# EasyEDA Pro project 01_立创eda专业版_esp32语音助手-自制版_2024-07-09.epro, board PCB1
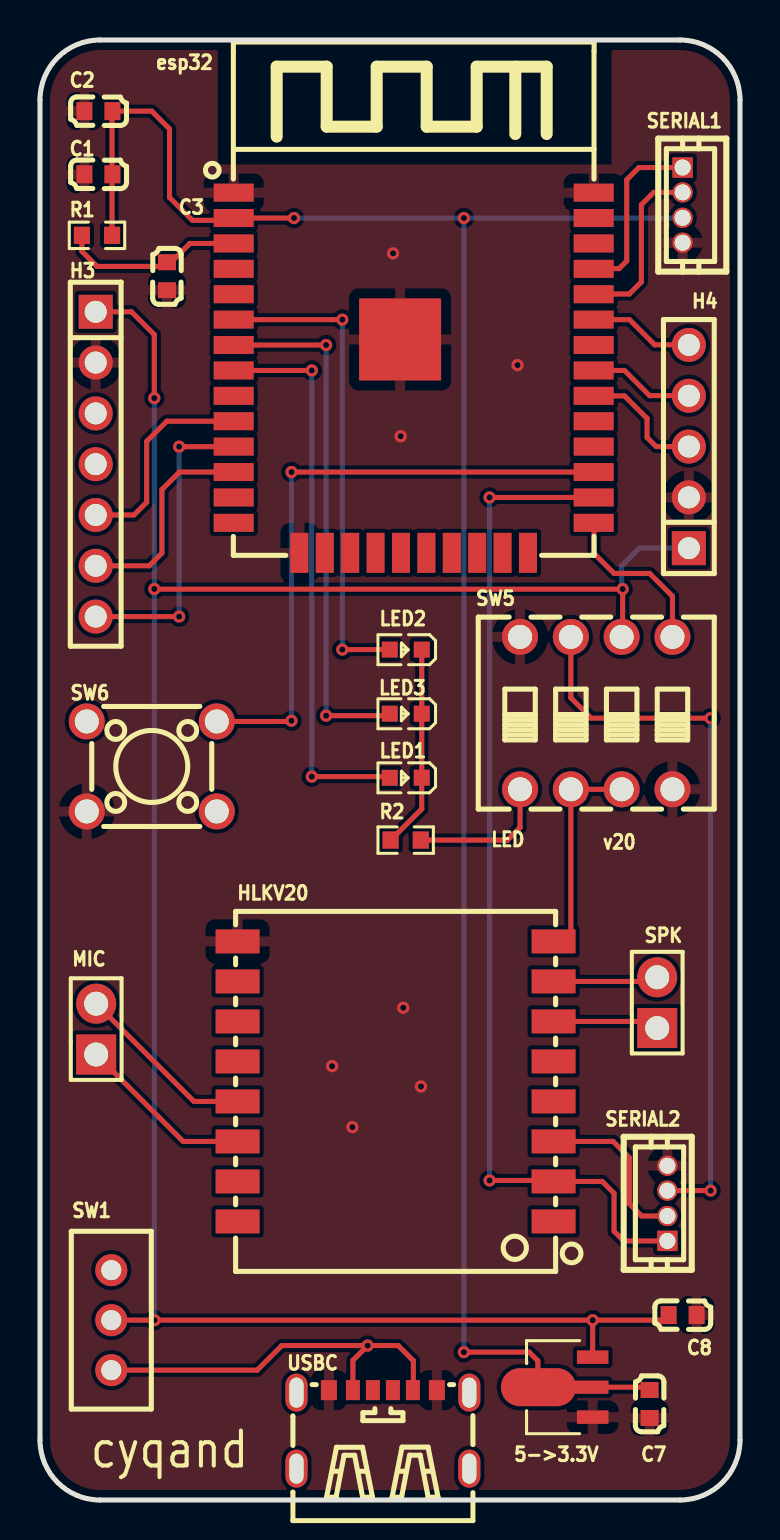
[diagram p14: board, top side]
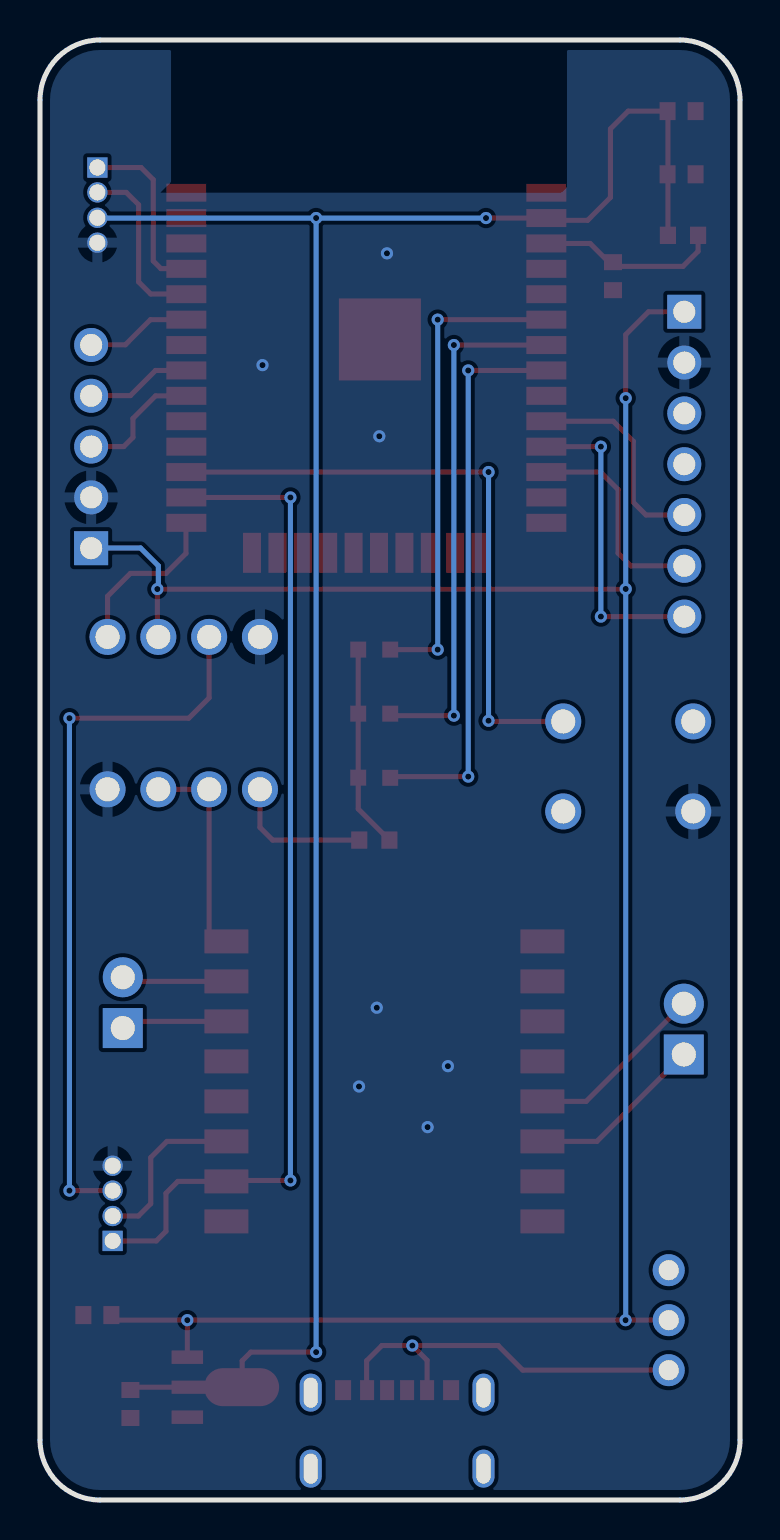
[diagram p15: board, bottom side, seen from below]

Outline 35 x 73 mm; copper layers: Top Layer, Bottom Layer. Coordinates in mm from the lower left corner of the outline.
Outline path: 0,70 0,3 arc(0.88,0.88) 3,0 32,0 arc(34.12,0.88) 35,3 35,70 arc(34.12,72.12) 32,73 3,73 arc(0.88,72.12) 0,70
Stack: Top Layer 0.035mm / Dielectric1 1.51mm FR4 er 4.5 / Bottom Layer 0.035mm

## Design rules (mm)
template: JLCPCB Capability(Two Layers Board)
spacing copperThickness1oz (default): track to track 0.102, other pairs 0.152 to 0.3
spacing copperThickness2oz: track to track 0.203, other pairs 0.152 to 0.3
track width copperThickness1oz (default): min 0.127, default 0.254, max 2.54
track width copperThickness2oz: min 0.203, default 0.254, max 2.54
differential pair differentialPair (default): width min 0.127, default 0.254, max 2.54; gap min 0.152, default 0.152
via viaSize (default): diameter min 0.5, default 0.61, max 10; hole min 0.3, default 0.305, max 6.3

## Placement (name value [footprint] x y rotation side)
5->3.3V  AMS1117-3.3V  [SOT-89-3_L4.5-W2.5-P1.50-LS4.2-BR]  26.28 5.64 0 top
C1  100nF  [C0603]  2.92 66.29 180 top
C2  10uF  [C0603]  2.92 69.44 180 top
C3  100nF  [C0603]  6.35 61.19 90 top
C7  10uF  [C0603]  30.48 4.8 270 top
C8  10uF  [C0603]  32.13 9.25 180 top
esp32  ESP32-WROOM-32-N4  [WIFIM-SMD_ESP32-WROOM-32-N4]  18.68 56.36 0 top
H3  PZ254V-11-07P  [HDR-TH_7P-P2.54-V-M]  2.79 51.79 270 top
H4  PZ254V-11-05P  [HDR-TH_5P-P2.54-V-M]  32.44 52.67 90 top
HLKV20  HLK-V20  [SMD-16_L18.0-W16.0-P2.00-HLK-V20]  17.78 20.93 180 top
LED1  NCD0603R1  [LED0603-RD_RED]  18.29 36.11 180 top
LED2  NCD0603G1  [LED0603-RD]  18.29 42.52 180 top
LED3  NCD0603B1  [LED0603-RD]  18.29 39.32 180 top
MIC  PZ254V-11-02P  [HDR-TH_2P-P2.54-V-M]  2.81 23.55 90 top
R1  10kΩ  [R0603]  2.85 63.23 0 top
R2  1kΩ  [R0603]  18.28 33 180 top
SERIAL1  DF13-4P-1.25DSA  [CONN-TH_DF13-4P-1.25DSA]  32.13 64.75 90 top
SERIAL2  DF13-4P-1.25DSA  [CONN-TH_DF13-4P-1.25DSA]  31.37 14.83 270 top
SPK  PZ254V-11-02P  [HDR-TH_2P-P2.54-V-M]  30.86 24.87 90 top
SW1  SS-12D00-G3  [SW-TH_SS-12D00-G3]  3.56 8.99 90 top
SW5  DSWB04LHGET  [SW-TH_DSWB04LHGET]  27.81 39.34 0 top
SW6  TS-1002-07026  [SW-TH_4P-L6.0-W6.0-P4.50-LS6.5]  5.59 36.68 0 top
USBC  TYPE-C 6P(073)  [TYPE-C-SMD_TYPE-C-6P]  17.15 3.53 0 top

## Footprints (pads in the part's own frame, mm; a bottom-side part is the same pattern mirrored in y, then rotated)
C0603
  rect 0.8x0.9 smd: 1(-0.7,0) 2(0.7,0)
CONN-TH_DF13-4P-1.25DSA
  rect 1.016x1.016 hole 0.8: 1(1.879,0)
  round 1.016 hole 0.8: 2(0.635,0) 3(-0.635,0) 4(-1.879,0)
HDR-TH_2P-P2.54-V-M
  rect 2x2 hole 1.2: 1(-1.27,0)
  round 2 hole 1.2: 2(1.27,0)
HDR-TH_5P-P2.54-V-M
  rect 1.7x1.7 hole 1.1: 1(-5.08,0)
  round 1.7 hole 1.1: 2(-2.54,0) 3(0,0) 4(2.54,0) 5(5.08,0)
HDR-TH_7P-P2.54-V-M
  rect 1.7x1.7 hole 1.1: 1(-7.62,0)
  round 1.7 hole 1.1: 2(-5.08,0) 3(-2.54,0) 4(0,0) 5(2.54,0) 6(5.08,0) 7(7.62,0)
LED0603-RD
  rect 0.8x0.8 smd: 1(-0.799,0) 2(0.799,0)
LED0603-RD_RED
  rect 0.8x0.8 smd: 1(-0.799,-0.004) 2(0.799,0.004)
R0603
  rect 0.806x0.864 smd: 1(-0.753,0) 2(0.753,0)
SMD-16_L18.0-W16.0-P2.00-HLK-V20
  rect 2.2x1.2 smd: 1(-7.9,7) 2(-7.9,5) 3(-7.9,3) 4(-7.9,1) 5(-7.9,-1) 6(-7.9,-3) 7(-7.9,-5) 8(-7.9,-7) 9(7.9,-7) 10(7.9,-5) 11(7.9,-3) 12(7.9,-1) 13(7.9,1) 14(7.9,3) 15(7.9,5) 16(7.9,7)
SOT-89-3_L4.5-W2.5-P1.50-LS4.2-BR
  rect 1.575x0.672 smd: 1(1.356,-1.5) 3(1.356,1.5)
  custom 5.377x1.9 smd: 2(-1.356,0)
SW-TH_4P-L6.0-W6.0-P4.50-LS6.5
  round 1.8 hole 1.2: 1(-3.25,2.25) 2(3.25,2.25) 3(-3.25,-2.25) 4(3.25,-2.25)
SW-TH_DSWB04LHGET
  round 1.8 hole 1.2: 1(-3.81,3.81) 2(-1.27,3.81) 3(1.27,3.81) 4(3.81,3.81) 5(-3.81,-3.81) 6(-1.27,-3.81) 7(1.27,-3.81) 8(3.81,-3.81)
SW-TH_SS-12D00-G3
  round 1.6 hole 1: 1(-2.5,0) 2(0,0) 3(2.5,0)
TYPE-C-SMD_TYPE-C-6P
  oval 1.1x1.9 hole 0.7x1.5: 7(-4.32,1.837) 7(-4.32,-1.962) 7(4.32,1.837) 7(4.32,-1.962)
  rect 0.7x1 smd: A5(-0.5,1.962) A9(1.5,1.962) B5(0.5,1.962) B9(-1.5,1.962)
  rect 0.8x1 smd: A12(2.7,1.962) B12(-2.7,1.962)
WIFIM-SMD_ESP32-WROOM-32-N4
  rect 2x0.9 smd: 1(-9,9.005) 2(-9,7.735) 3(-9,6.465) 4(-9,5.195) 5(-9,3.925) 6(-9,2.655) 7(-9,1.385) 8(-9,0.115) 9(-9,-1.155) 10(-9,-2.425) 11(-9,-3.695) 12(-9,-4.965) 13(-9,-6.235) 14(-9,-7.505) 25(9,-7.505) 26(9,-6.235) 27(9,-4.965) 28(9,-3.695) 29(9,-2.425) 30(9,-1.155) 31(9,0.115) 32(9,1.385) 33(9,2.655) 34(9,3.925) 35(9,5.195) 36(9,6.465) 37(9,7.735) 38(9,9.005)
  rect 0.9x2 smd: 15(-5.715,-9.005) 16(-4.445,-9.005) 17(-3.175,-9.005) 18(-1.905,-9.005) 19(-0.635,-9.005) 20(0.635,-9.005) 21(1.905,-9.005) 22(3.175,-9.005) 23(4.445,-9.005) 24(5.715,-9.005)
  rect 4.1x4.1 smd: 39(-0.68,1.665)

## Nets
As in the schematic.

Pads without a net: esp32 4 5 9 13 14 16 17 18 19 20 21 22 23 24 28 29 32 36 37; H3 3 4; HLKV20 1 4 5 10 11 12 15 16; SW1 3; SW6 1 4; USBC 7 A5 B5

## Via types
v1: diameter 0.61, hole 0.305, Top Layer to Bottom Layer, 30 vias

## Routing (per net, layer and track width the routed paths; a pad name or vN(x,y) marks a point on that pad's centre or on a via; arc(x,y) is an arc through that point)
3V3: length 105.8
  Top Layer w0.254: v1(21.19,7.39) 24.46,7.39 24.89,6.96 24.89,5.67 5->3.3V.2 ; 25.73,5.64 30.34,5.64 C7.1 ; R1.2 3.6,69.43 C2.1 5.59,69.44 6.48,68.56 6.48,65.13 7.62,63.98 9.57,63.98 esp32.2 v1(12.7,64.1)
  Bottom Layer w0.254: v1(12.7,64.1) 32.12,64.1 SERIAL1.3 ; v1(21.19,7.39) v1(21.19,64.1)
5V: length 113.2
  Top Layer w0.254: H3.1 4.57,59.41 5.72,58.27 v1(5.72,55.09) ; SW1.2 31.18,8.99 C8.2 ; 5.72,45.54 29.08,45.54 ; 5->3.3V.3 v1(27.63,8.99) ; v1(29.13,45.55) 29.13,43.2 SW5.3
  Bottom Layer w0.254: v1(5.72,55.09) 5.72,8.99 ; 29.08,45.54 29.08,46.71 29.97,47.6 32.43,47.6 H4.1
  vias: v1(5.72,45.55) v1(5.72,8.99)
5VIN: length 19.9
  Top Layer w0.254: SW1.1 10.86,6.49 12.09,7.72 v1(16.38,7.72) ; v1(16.38,7.72) 15.65,6.98 USBC.B9 ; v1(16.38,7.72) 17.91,7.72 18.67,6.96 18.67,5.52 USBC.A9
GND:
  vias: v1(14.6,21.69) v1(15.62,18.64) v1(17.65,62.33) v1(18.03,53.19) v1(18.16,24.61) v1(19.05,20.68) v1(23.88,56.74)
IO4: length 50.6
  Top Layer w0.254: v1(22.48,15.98) 25.63,15.98 HLKV20.2 28.11,15.93 28.7,15.34 28.7,13.44 29.18,12.95 SERIAL2.1 ; esp32.26 v1(22.48,50.13)
  Bottom Layer w0.254: v1(22.48,50.13) v1(22.48,15.98)
IO16: length 31.3
  Top Layer w0.254: SW6.2 12.54,38.93 v1(12.57,38.96) ; esp32.27 v1(12.57,51.4)
  Bottom Layer w0.254: v1(12.57,51.4) v1(12.57,38.96)
IO26: length 15.4
  Top Layer w0.254: v1(6.96,44.17) 2.79,44.17 ; esp32.11 v1(6.96,52.67)
  Bottom Layer w0.254: v1(6.96,52.67) v1(6.96,44.17)
IO32: length 28.1
  Top Layer w0.254: esp32.8 v1(13.59,56.48) ; v1(13.59,36.17) 17.49,36.17
  Bottom Layer w0.254: v1(13.59,56.48) v1(13.59,36.17)
IO34: length 24.3
  Top Layer w0.254: esp32.6 v1(15.12,59.02) ; v1(15.12,42.52) LED2.2
  Bottom Layer w0.254: v1(15.12,59.02) v1(15.12,42.52)
IO35: length 26.3
  Top Layer w0.254: esp32.7 v1(14.31,57.75) ; v1(14.31,39.22) 17.49,39.22
  Bottom Layer w0.254: v1(14.31,57.75) v1(14.31,39.22)
SERIAL_VCC: length 36.2
  Top Layer w0.254: 26.54,43.16 26.54,40.11 27.56,39.09 v1(33.53,39.09) ; 31.37,15.47 v1(33.53,15.47)
  Bottom Layer w0.254: v1(33.53,39.09) v1(33.53,15.47)
V20_RX: length 8.6
  Top Layer w0.254: HLKV20.3 28.65,17.93 29.46,17.12 29.46,14.82 30.08,14.2 SERIAL2.2
HLKV20_VCC: length 10.3
  Top Layer w0.254: SW5.7 26.54,35.53 26.54,27.92 26.42,27.79
IO0: length 8.2
  Top Layer w0.254: 27.7,48.65 27.7,47.33 28.7,46.33 30.48,46.33 31.62,45.19 SW5.4
IO18: length 6.4
  Top Layer w0.254: esp32.30 29.22,55.21 30.35,54.08 30.35,53.13 30.81,52.67 H4.3
IO19: length 5.3
  Top Layer w0.254: esp32.31 29.22,56.48 30.48,55.22 32.43,55.22 H4.4
IO21: length 5.3
  Top Layer w0.254: esp32.33 29.48,59.02 30.73,57.76 32.43,57.76 H4.5
IO25: length 10.6
  Top Layer w0.254: 2.79,49.25 4.7,49.25 5.33,49.89 5.33,52.93 6.34,53.94 esp32.10
IO27: length 10.7
  Top Layer w0.254: H3.6 5.46,46.71 6.1,47.35 6.1,50.52 6.97,51.4 esp32.12
LED_CTRL: length 7.1
  Top Layer w0.254: 19.04,33 23.37,33 24,33.63 SW5.5
MIC+: length 8.9
  Top Layer w0.254: MIC.1 7.16,17.93 HLKV20.14
MIC-: length 9.1
  Top Layer w0.254: MIC.2 7.7,19.93 HLKV20.13
RXD: length 8.8
  Top Layer w0.254: esp32.34 27.7,60.3 29.46,60.3 30.07,60.91 30.07,64.76 30.69,65.38 SERIAL1.2
SPK+: length 5.3
  Top Layer w0.254: HLKV20.6 30.53,23.93 30.86,23.6
SPK-: length 5.2
  Top Layer w0.254: HLKV20.7 30.86,25.93
TXD: length 8.9
  Top Layer w0.254: esp32.35 27.7,61.57 28.96,61.57 29.34,61.95 29.34,66.02 29.95,66.62 SERIAL1.1
$1N784: length 9.2
  Top Layer w0.254: R1.1 2.1,62.43 2.85,61.68 6.35,61.68 7.49,62.83 esp32.3
$3N1069: length 10.1
  Top Layer w0.254: R2.2 19.09,34.55 LED1.1 19.09,42.46

## Copper pours and planes (outline as drawn; the poured copper is in the pictures)
GND on Top Layer: -0.89,73.25 8.89,73.25 8.89,66.78 28.57,66.78 28.57,73.76 35.56,73.76 35.69,73.64 35.69,-0.41 35.05,-1.04 2.03,-1.04 1.78,-1.29 -1.14,1.63 -1.14,8.48 -1.4,8.74 -1.4,72.75
GND on Bottom Layer: -2.41,74.78 7.13,74.78 8.65,73.25 8.65,65.64 8.93,65.37 28.98,65.37 28.45,65.9 28.45,75.16 37.34,75.16 38.99,73.51 38.99,-4.34 37.47,-5.87 -2.03,-5.87 -3.94,-3.96 -3.94,73.25

## Text on the board
Top Silkscreen Layer: LED | v20 | cyqand
